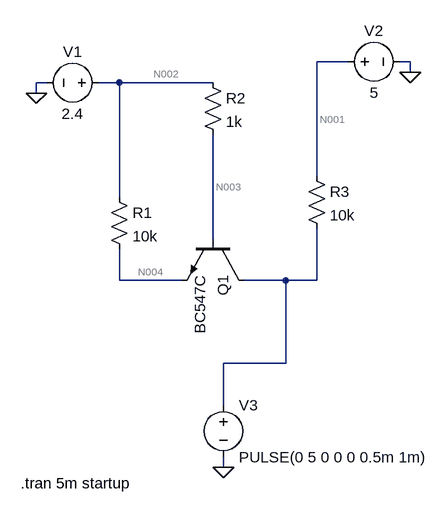
[diagram p0: schematic LS.asc]
LS.asc, the LTspice schematic file:
Version 4
SHEET 1 880 680
WIRE 352 -96 304 -96
WIRE 448 -96 432 -96
WIRE 448 -80 448 -96
WIRE -112 -64 -128 -64
WIRE 0 -64 -32 -64
WIRE 144 -64 0 -64
WIRE -128 -48 -128 -64
WIRE 304 80 304 -96
WIRE 0 112 0 -64
WIRE 144 176 144 16
WIRE 0 240 0 192
WIRE 96 240 0 240
WIRE 256 240 192 240
WIRE 304 240 304 160
WIRE 304 240 256 240
WIRE 256 368 256 240
WIRE 256 368 160 368
WIRE 160 432 160 368
WIRE 160 528 160 512
FLAG 160 528 0
FLAG -128 -48 0
FLAG 448 -80 0
SYMBOL npn 192 176 R90
SYMATTR InstName Q1
SYMATTR Value BC547C
SYMBOL res -16 96 R0
SYMATTR InstName R1
SYMATTR Value 10k
SYMBOL res 128 -80 R0
SYMATTR InstName R2
SYMATTR Value 1k
SYMBOL res 288 64 R0
SYMATTR InstName R3
SYMATTR Value 10k
SYMBOL voltage -16 -64 R90
WINDOW 0 -32 56 VBottom 2
WINDOW 3 32 56 VTop 2
WINDOW 123 0 0 Left 0
WINDOW 39 0 0 Left 0
SYMATTR InstName V1
SYMATTR Value 2.4
SYMBOL voltage 336 -96 R270
WINDOW 0 32 56 VTop 2
WINDOW 3 -32 56 VBottom 2
WINDOW 123 0 0 Left 0
WINDOW 39 0 0 Left 0
SYMATTR InstName V2
SYMATTR Value 5
SYMBOL voltage 160 416 R0
WINDOW 123 0 0 Left 0
WINDOW 39 0 0 Left 0
SYMATTR InstName V3
SYMATTR Value PULSE(0 5 0 0 0 0.5m 1m)
TEXT -152 552 Left 2 !.tran 5m startup

The netlist it stands for:
* LS.asc
Q1 N005 N003 N004 0 BC547C
R1 N002 N004 10k
R2 N002 N003 1k
R3 N001 N005 10k
V1 N002 0 2.4
V2 N001 0 5
V3 N005 0 PULSE(0 5 0 0 0 0.5m 1m)
.model NPN NPN
.model PNP PNP
.lib standard.bjt
.tran 5m startup
.backanno
.end

* Results of the author's LTspice run, read from the files saved beside the schematic
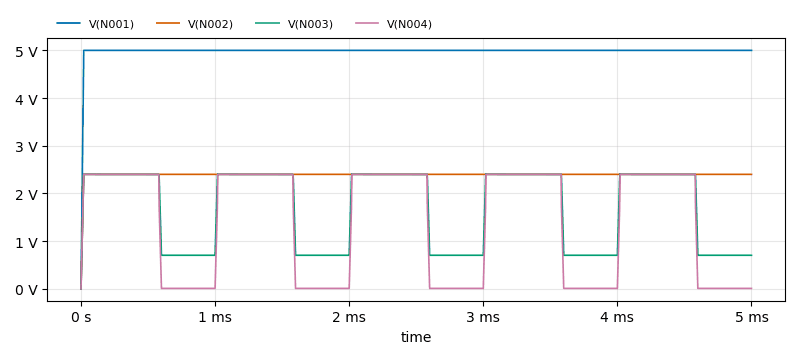
[diagram p1: Transient Analysis of LS.asc, plotted from the saved traces]
* Transient Analysis, 1 run:
*   V(N001): min 0 V, max 5 V, average 4.99 V, rms 4.993 V, last 5 V
*   V(N002): min 0 V, max 2.4 V, average 2.395 V, rms 2.397 V, last 2.4 V
*   V(N003): min 0 V, max 2.407 V, average 1.69 V, rms 1.882 V, last 703.4 mV
*   V(N004): min 0 V, max 2.4 V, average 1.39 V, rms 1.813 V, last 8.736 mV